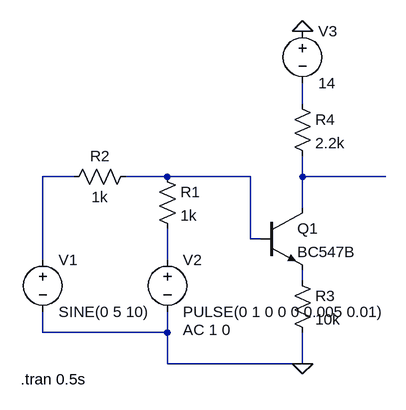
[diagram p0: schematic sampling gen.asc]
sampling gen.asc, the LTspice schematic file:
Version 4
SHEET 1 880 680
WIRE 528 -176 528 -208
WIRE 176 -64 128 -64
WIRE 320 -64 256 -64
WIRE 448 -64 320 -64
WIRE 528 -64 528 -96
WIRE 656 -64 528 -64
WIRE 528 -16 528 -64
WIRE 448 32 448 -64
WIRE 464 32 448 32
WIRE 128 64 128 -64
WIRE 320 64 320 16
WIRE 528 96 528 80
WIRE 128 176 128 144
WIRE 320 176 320 144
WIRE 320 176 128 176
WIRE 320 224 320 176
WIRE 528 224 528 176
WIRE 528 224 320 224
FLAG 528 -288 0
FLAG 528 224 0
SYMBOL voltage 128 48 R0
WINDOW 123 0 0 Left 0
WINDOW 39 0 0 Left 0
SYMATTR InstName V1
SYMATTR Value SINE(0 5 10)
SYMBOL voltage 320 48 R0
WINDOW 123 24 124 Left 2
WINDOW 39 0 0 Left 0
SYMATTR InstName V2
SYMATTR Value PULSE(0 1 0 0 0 0.005 0.01)
SYMATTR Value2 AC 1 0
SYMBOL res 304 -80 R0
SYMATTR InstName R1
SYMATTR Value 1k
SYMBOL res 272 -80 R90
WINDOW 0 0 56 VBottom 2
WINDOW 3 32 56 VTop 2
SYMATTR InstName R2
SYMATTR Value 1k
SYMBOL npn 464 -16 R0
SYMATTR InstName Q1
SYMATTR Value BC547B
SYMBOL res 512 80 R0
SYMATTR InstName R3
SYMATTR Value 10k
SYMBOL res 512 -192 R0
SYMATTR InstName R4
SYMATTR Value 2.2k
SYMBOL voltage 528 -304 R0
WINDOW 123 0 0 Left 0
WINDOW 39 0 0 Left 0
SYMATTR InstName V3
SYMATTR Value 14
TEXT 94 248 Left 2 !.tran 0.5s

The netlist it stands for:
* sampling gen.asc
V1 N002 0 SINE(0 5 10)
V2 N005 0 PULSE(0 1 0 0 0 0.005 0.01) AC 1 0
R1 N003 N005 1k
R2 N003 N002 1k
Q1 N004 N003 N006 0 BC547B
R3 N006 0 10k
R4 N001 N004 2.2k
V3 0 N001 14
.model NPN NPN
.model PNP PNP
.lib standard.bjt
.tran 0.5s
.backanno
.end